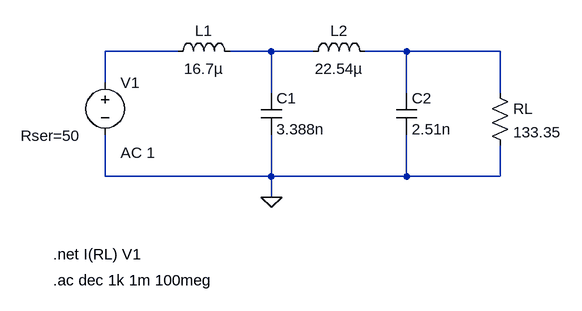
[diagram p0: schematic Desnormalizado.asc]
Desnormalizado.asc, the LTspice schematic file:
Version 4
SHEET 1 880 680
WIRE 16 128 -96 128
WIRE 160 128 96 128
WIRE 224 128 160 128
WIRE 368 128 304 128
WIRE 512 128 368 128
WIRE -96 176 -96 128
WIRE 160 192 160 128
WIRE 368 192 368 128
WIRE 512 192 512 128
WIRE -96 320 -96 256
WIRE 160 320 160 256
WIRE 160 320 -96 320
WIRE 368 320 368 256
WIRE 368 320 160 320
WIRE 512 320 512 272
WIRE 512 320 368 320
WIRE 160 352 160 320
FLAG 160 352 0
SYMBOL ind 0 144 R270
WINDOW 0 32 56 VTop 2
WINDOW 3 5 56 VBottom 2
SYMATTR InstName L1
SYMATTR Value 16.7µ
SYMBOL cap 144 192 R0
SYMATTR InstName C1
SYMATTR Value 3.388n
SYMBOL ind 208 144 R270
WINDOW 0 32 56 VTop 2
WINDOW 3 5 56 VBottom 2
SYMATTR InstName L2
SYMATTR Value 22.54µ
SYMBOL cap 352 192 R0
SYMATTR InstName C2
SYMATTR Value 2.51n
SYMBOL res 496 176 R0
SYMATTR InstName RL
SYMATTR Value 133.35
SYMBOL voltage -96 160 R0
WINDOW 123 24 124 Left 2
WINDOW 39 -130 98 Left 2
SYMATTR Value2 AC 1
SYMATTR SpiceLine Rser=50
SYMATTR InstName V1
SYMATTR Value ""
TEXT -176 440 Left 2 !.net I(RL) V1
TEXT -176 480 Left 2 !.ac dec 1k 1m 100meg

The netlist it stands for:
* Desnormalizado.asc
L1 N001 N002 16.7µ
C1 N002 0 3.388n
L2 N002 N003 22.54µ
C2 N003 0 2.51n
RL N003 0 133.35
V1 N001 0 AC 1 Rser=50
.net I(RL) V1
.ac dec 1k 1m 100meg
.backanno
.end